# EAGLE design Touch control 1.8 (EAGLE 5.12)
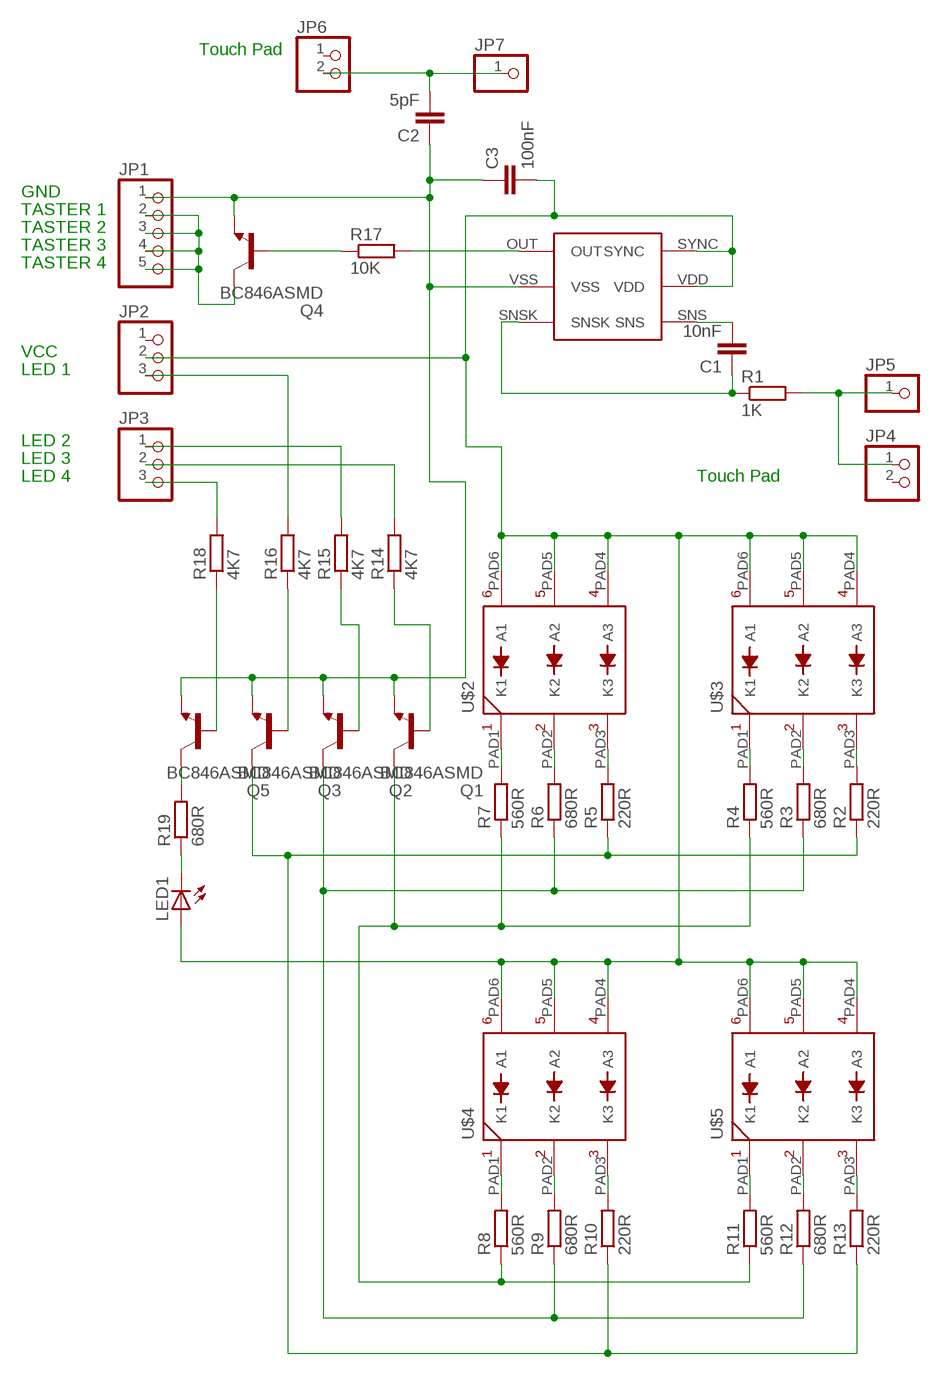
[diagram p0: schematic, sheet 1]

## Parts
C1  10nF  C-EUC1206  [C1206]
C2  5pF  C-EUC1206  [C1206]
C3  100nF  C-EUC1206  [C1206]
JP1  PINHD-1X05_2.00  [1X05M]
JP2  PINHD-1X03_2.00  [1X03M]
JP3  PINHD-1X03_2.00  [1X03M]
JP4  PINHD-1X2/90  [1X02/90]
JP5  PINHD-1X1  [1X01]
JP6  PINHD-1X2/90  [1X02/90]
JP7  PINHD-1X1  [1X01]
LED1  LEDSMT1206  [1206]
Q1  BC846ASMD  [SOT23]
Q2  BC846ASMD  [SOT23]
Q3  BC846ASMD  [SOT23]
Q4  BC846ASMD  [SOT23]
Q5  BC846ASMD  [SOT23]
QT1010  QT100A  [6-WSON]
R1  1K  RCL_R-EU_R1206  [RCL_R1206]
R2  220R  RCL_R-EU_R1206  [RCL_R1206]
R3  680R  RCL_R-EU_R1206  [RCL_R1206]
R4  560R  RCL_R-EU_R1206  [RCL_R1206]
R5  220R  RCL_R-EU_R1206  [RCL_R1206]
R6  680R  RCL_R-EU_R1206  [RCL_R1206]
R7  560R  RCL_R-EU_R1206  [RCL_R1206]
R8  560R  RCL_R-EU_R1206  [RCL_R1206]
R9  680R  RCL_R-EU_R1206  [RCL_R1206]
R10  220R  RCL_R-EU_R1206  [RCL_R1206]
R11  560R  RCL_R-EU_R1206  [RCL_R1206]
R12  680R  RCL_R-EU_R1206  [RCL_R1206]
R13  220R  RCL_R-EU_R1206  [RCL_R1206]
R14  4K7  RCL_R-EU_R1206  [RCL_R1206]
R15  4K7  RCL_R-EU_R1206  [RCL_R1206]
R16  4K7  RCL_R-EU_R1206  [RCL_R1206]
R17  10K  RCL_R-EU_R1206  [RCL_R1206]
R18  4K7  RCL_R-EU_R1206  [RCL_R1206]
R19  680R  RCL_R-EU_R1206  [RCL_R1206]
U$2  EIGENE_LED5050  [EIGENE_LED5050]
U$3  EIGENE_LED5050  [EIGENE_LED5050]
U$4  EIGENE_LED5050  [EIGENE_LED5050]
U$5  EIGENE_LED5050  [EIGENE_LED5050]

## Nets
N$1: JP1.2 JP1.3 JP1.4 JP1.5 Q4.3(C)
N$2: C1.2 QT1010.SNS
N$4: R13.2 U$5.PAD3(K3)
N$6: R12.2 U$5.PAD2(K2)
N$8: JP4.1 JP5.1 R1.2
N$9: R11.2 U$5.PAD1(K1)
N$10: C1.1 QT1010.SNSK R1.1
N$11: JP2.3 R16.2
N$12: R10.2 U$4.PAD3(K3)
N$13: JP3.1 R15.2
N$14: R9.2 U$4.PAD2(K2)
N$15: C2.2 JP6.2 JP7.1
N$17: R8.2 U$4.PAD1(K1)
N$18: QT1010.OUT R17.2
N$19: R7.2 U$2.PAD1(K1)
N$21: R6.2 U$2.PAD2(K2)
N$22: R5.2 U$2.PAD3(K3)
N$23: R4.2 U$3.PAD1(K1)
N$24: R3.2 U$3.PAD2(K2)
N$25: R2.2 U$3.PAD3(K3)
N$26: Q3.3(C) R2.1 R5.1 R10.1 R13.1
N$27: Q2.3(C) R3.1 R6.1 R9.1 R12.1
N$28: Q1.3(C) R4.1 R7.1 R8.1 R11.1
N$29: JP3.2 R14.2
N$30: Q4.1(B) R17.1
N$31: JP3.3 R18.2
N$32: Q5.1(B) R18.1
N$33: Q2.1(B) R15.1
N$34: Q1.1(B) R14.1
N$35: C2.1 C3.1 JP1.1 Q1.2(E) Q2.2(E) Q3.2(E) Q4.2(E) Q5.2(E) QT1010.VSS
N$36: Q5.3(C) R19.2
N$38: C3.2 JP2.2 LED1.A QT1010.SYNC QT1010.VDD U$2.PAD4(A3) U$2.PAD5(A2) U$2.PAD6(A1) U$3.PAD4(A3) U$3.PAD5(A2) U$3.PAD6(A1) U$4.PAD4(A3) U$4.PAD5(A2) U$4.PAD6(A1) U$5.PAD4(A3) U$5.PAD5(A2) U$5.PAD6(A1)
N$39: Q3.1(B) R16.1
N$40: LED1.C R19.1
Unconnected: JP2.1 JP4.2 JP6.1

## Notes on the sheet
- Touch Pad
- GND
- TASTER 1
- TASTER 2
- TASTER 3
- TASTER 4
- VCC
- LED 1
- LED 2
- LED 3
- LED 4 | Touch Pad

## Library data of the parts
C1-C3 = rcl:C-EU: CAPACITOR, European symbol
JP1 = pinhead-2:PINHD-1X05: PIN HEADER
JP2 JP3 = pinhead-2:PINHD-1X03: PIN HEADER
JP4 JP6 = pinhead:PINHD-1X2: PIN HEADER
JP5 JP7 = pinhead:PINHD-1X1: PIN HEADER
LED1 = led:LED: LED OSRAM: - CHIPLED LG R971, LG N971, LY N971, LG Q971, LY Q971, LO R971, LY R971 LH N974, LH R974 LS Q976, LO Q976, LY Q976 LO Q996 - Hyper CHIPLED LW Q18S LB Q993, LB Q99A, LB R99A - SideLED LS A670, LO A670, LY A670, LG A670, LP A670 LB A673, LV A673, LT A673, LW A673 LH A674 LY A675 LS A676, LA A676, LO A676, LY A676, LW A676 LS A679, LY A679, LG A679 - Hyper Micro SIDELED® LS Y876, LA Y876, LO Y876, LY Y876 LT Y87S - SmartLED LW L88C, LW L88S LB L89C, LB L89S, LG L890 LS L89K, LO L89K, LY L89K LS L896, LA L896, LO L896, LY L896 - TOPLED LS T670, LO T670, LY T670, LG T670, LP T670 LSG T670, LSP T670, LSY T670, LOP T670, LYG T670 LG T671, LOG T671, LSG T671 LB T673, LV T673, LT T673, LW T673 LH T674 LS T676, LA T676, LO T676, LY T676, LB T676, LH T676, LSB T676, LW T676 LB T67C, LV T67C, LT T67C, LS T67K, LO T67K, LY T67K, LW E67C LS E67B, LA E67B, LO E67B, LY E67B, LB E67C, LV E67C, LT E67C LW T67C LS T679, LY T679, LG T679 LS T770, LO T770, LY T770, LG T770, LP T770 LB T773, LV T773, LT T773, LW T773 LH T774 LS E675, LA E675, LY E675, LS T675 LS T776, LA T776, LO T776, LY T776, LB T776 LHGB T686 LT T68C, LB T68C - Hyper Mini TOPLED® LB M676 - Mini TOPLED Santana® LG M470 LS M47K, LO M47K, LY M47K Source: http://www.osram.convergy.de LUXEON: - LUMILED® LXK2-PW12-R00, LXK2-PW12-S00, LXK2-PW14-U00, LXK2-PW14-V00 LXK2-PM12-R00, LXK2-PM12-S00, LXK2-PM14-U00 LXK2-PE12-Q00, LXK2-PE12-R00, LXK2-PE12-S00, LXK2-PE14-T00, LXK2-PE14-U00 LXK2-PB12-K00, LXK2-PB12-L00, LXK2-PB12-M00, LXK2-PB14-N00, LXK2-PB14-P00, LXK2-PB14-Q00 LXK2-PR12-L00, LXK2-PR12-M00, LXK2-PR14-Q00, LXK2-PR14-R00 LXK2-PD12-Q00, LXK2-PD12-R00, LXK2-PD12-S00 LXK2-PH12-R00, LXK2-PH12-S00 LXK2-PL12-P00, LXK2-PL12-Q00, LXK2-PL12-R00 Source: www.luxeon.com KINGBRIGHT: KA-3528ASYC Source: www.kingbright.com
Q1-Q5 = transistor-npn:BC846*: NPN Transistor
QT1010 = QT100A:QT100A: ATMEL QT100A
R1-R19 = EAGLE_HUCKEPACK:RCL_R-EU_: RESISTOR, European symbol
U$2-U$5 = EAGLE_HUCKEPACK:EIGENE_LED5050

## Board
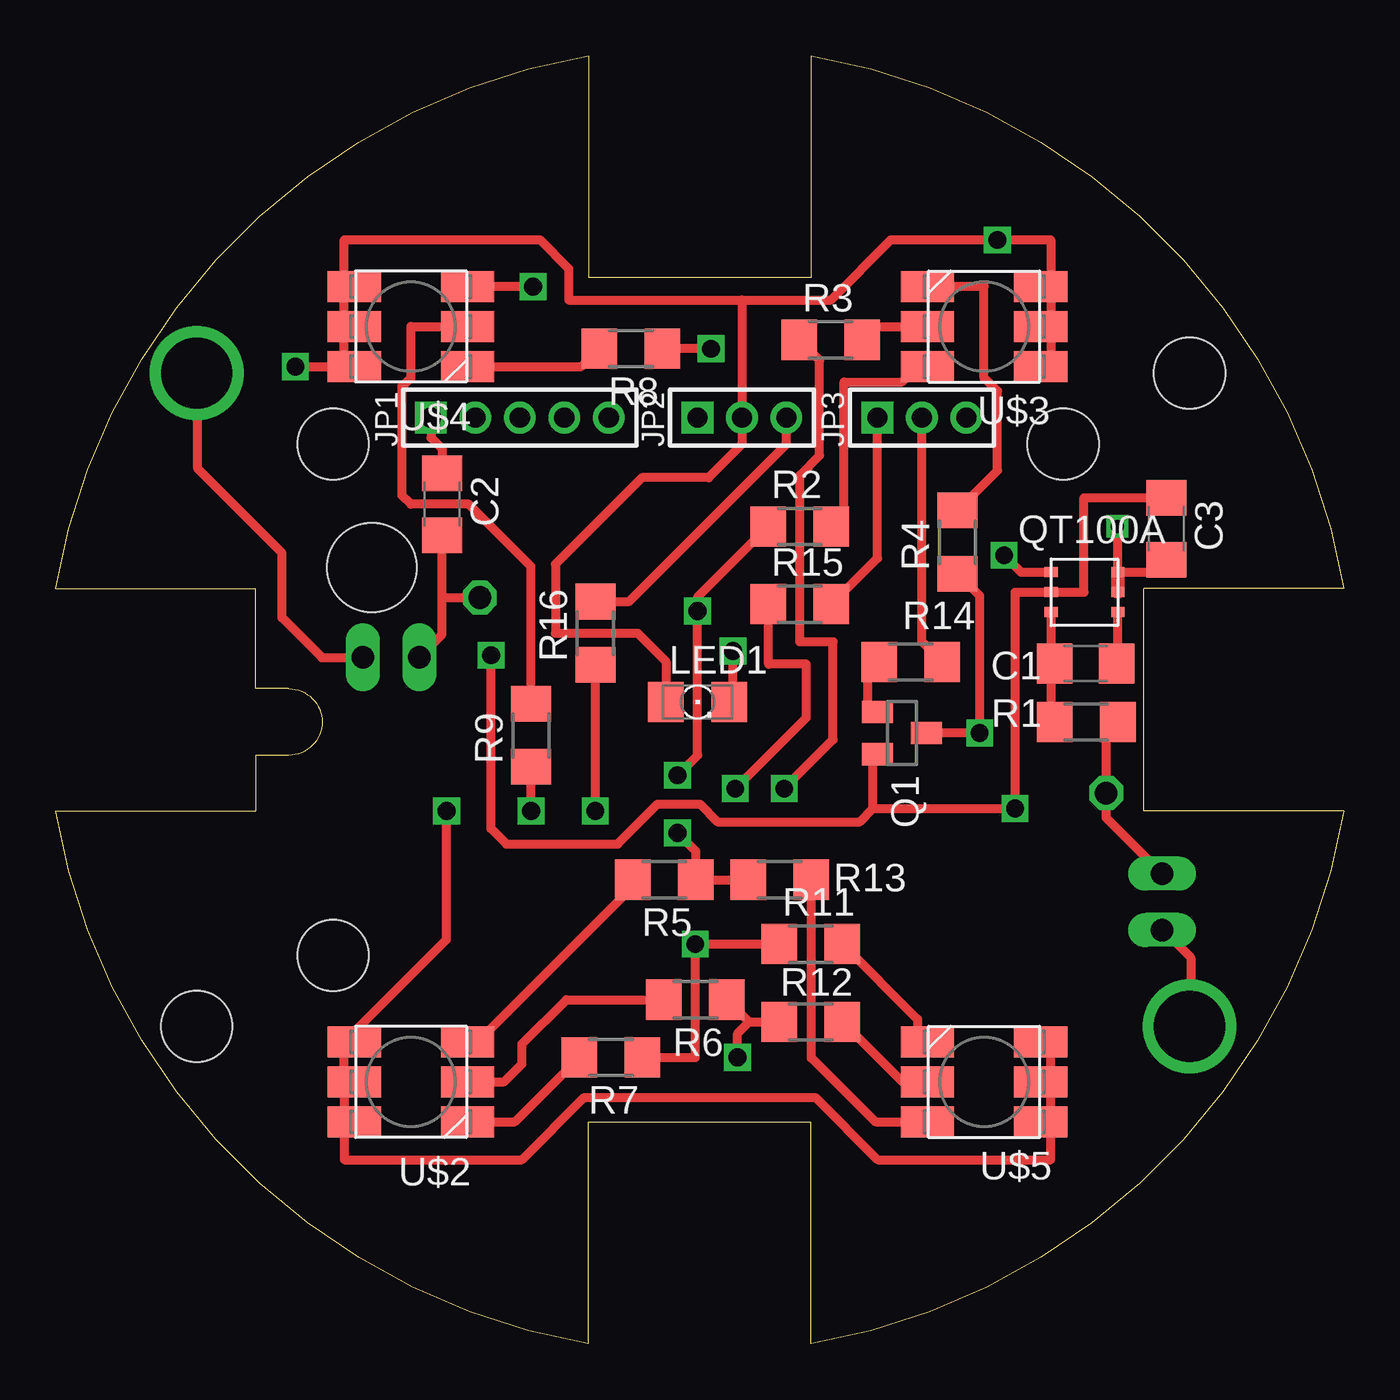
[diagram p1: board, top side]
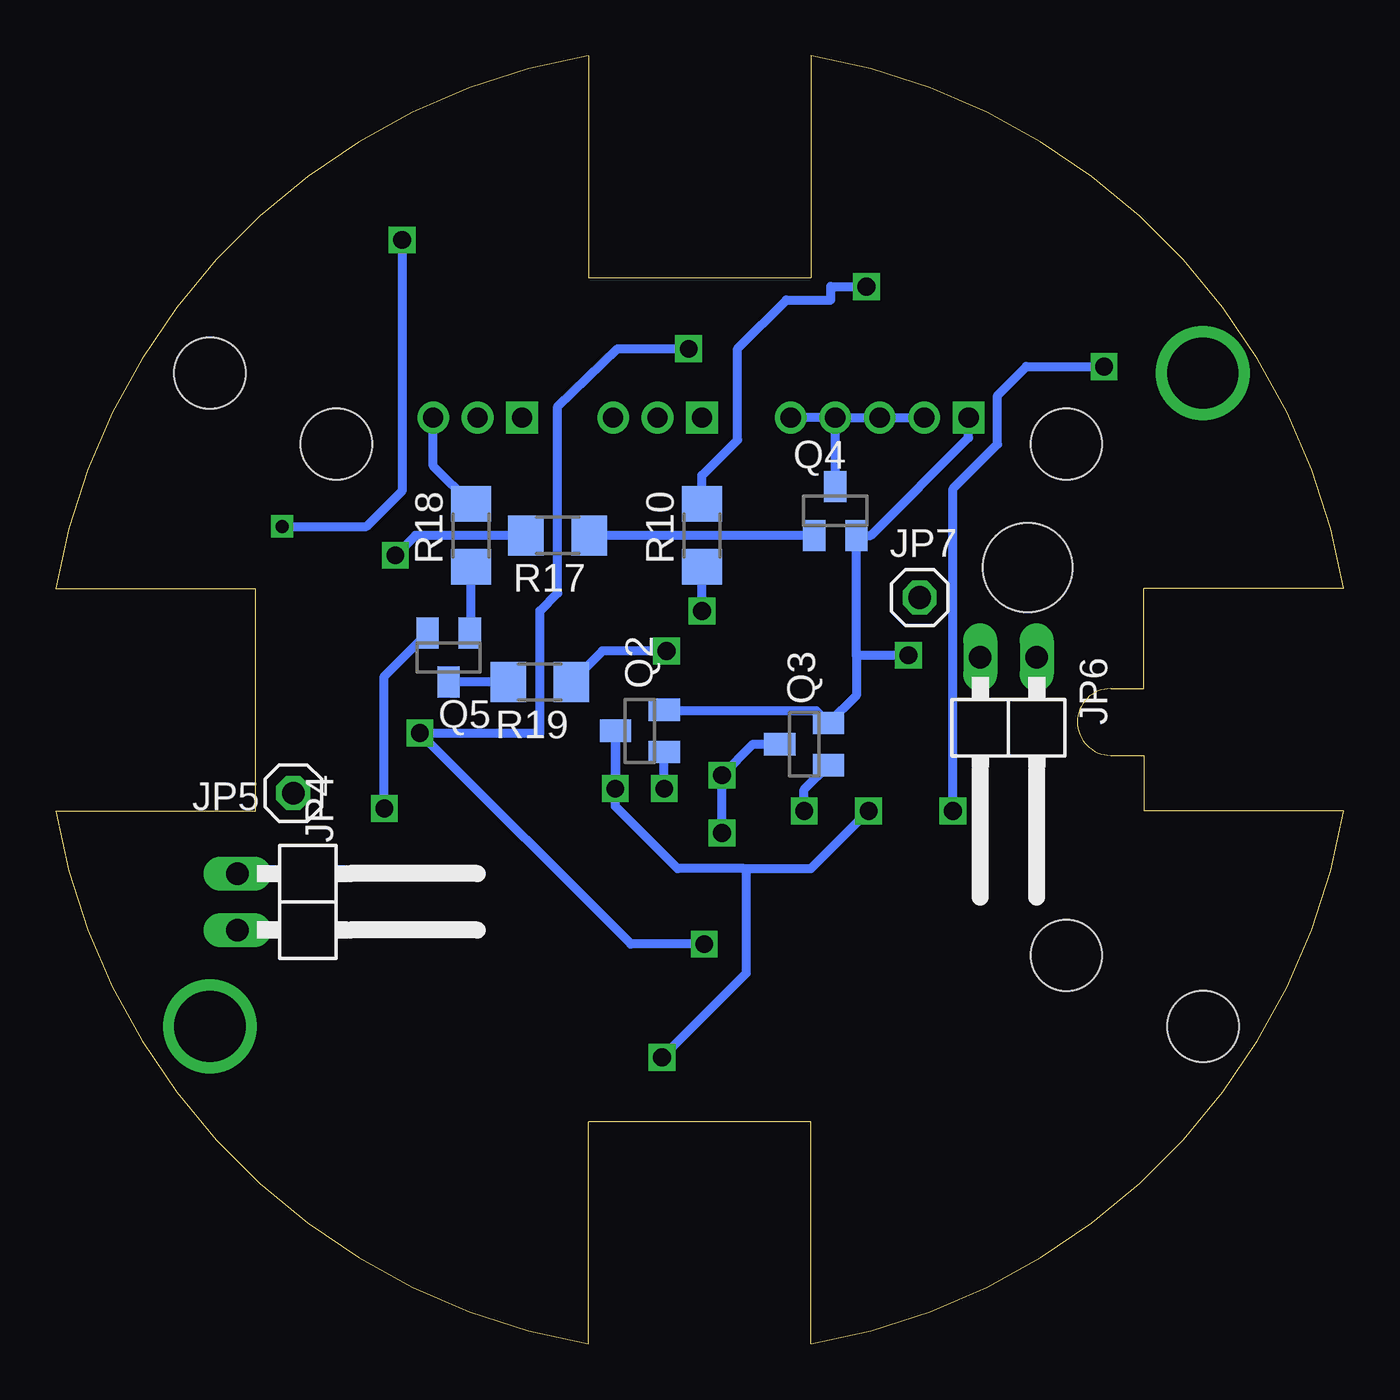
[diagram p2: board, bottom side, seen from below]

Size 58 x 58 mm. Coordinates in mm from the lower left corner, seen from the top.
Outline: 49,24 49,34 58,34 arc70 34,58 34,48 24,48 24,58 arc70 0,34 9,34 9,29.5 10.5,29.5 arc-180 10.5,26.5 9,26.5 9,24 0,24 arc70 24,0 24,10 34,10 34,0 arc70 58,24 49,24
Copper layers (1*16): Top 0.035mm / dielectric 1.5mm / Bottom 0.035mm
Design rules "default *": minimum track width 10mil, minimum drill 24mil, track to track 0.3mm, track to pad 0.3mm, pad to pad 0.3mm, via to via 0.3mm, smd to smd 8mil, copper to edge 0.3mm, drill to drill 0.3mm, minimum pad ring 10mil, minimum via ring 8mil, stop-mask expansion 4mil, vias tented up to drill 0mil, thermal gap 10mil
Holes 3.2 mm at 12.49,40.51 45.35,40.51 12.49,17.49 6.35,14.3 51.05,43.7
Holes 4 mm at 14.24,34.96

### Footprints (pad centres in the part's own frame; a part is rotated, then mirrored left to right if it is on the bottom)
C1206 = smd 1.6 x 1.8: 1 -1.4,0; 2 1.4,0
1X05M = drill 0.914 square: 1 -4,0 | drill 0.914 round: 2 -2,0; 3 0,0; 4 2,0; 5 4,0
1X03M = drill 0.914 square: 1 -2,0 | drill 0.914 round: 2 0,0; 3 2,0
1X02/90 = drill 1.016 long: 1 -1.27,-3.81; 2 1.27,-3.81
1X01 = drill 1.016 octagon: 1 0,0
1206 = smd 1.6 x 1.803: A -1.422,0; C 1.422,0
SOT23 = smd 1 x 1.4: 1 -0.95,-1.1; 2 0.95,-1.1; 3 0,1.1
6-WSON = smd 0.6 x 0.45: OUT -1,0.4; SNS 2,-1.4; SNSK -1,-1.4; SYNC 2,0.4; VDD 2,-0.5; VSS -1,-0.5
RCL_R1206 = smd 1.6 x 1.803: 1 -1.422,0; 2 1.422,0
EIGENE_LED5050 = smd 1.5 x 1.4: PAD1 -3,1.8; PAD1A -2.1,1.8; PAD2 -3,0; PAD2A -2.1,0; PAD3 -3,-1.8; PAD3A -2.1,-1.8; PAD4 3,-1.8; PAD4A 2.1,-1.8; PAD5 3,0; PAD5A 2.1,0; PAD6 3,1.8; PAD6A 2.1,1.8

### Placement (x,y rotation side)
C1  46.37,30.64 0 top
C2  17.4,37.8 270 top
C3  50,36.7 270 top
JP1  20.9,41.7 0 top
JP2  30.9,41.7 0 top
JP3  39,41.7 0 top
JP4  46,19.9 270 bottom
JP5  47.3,24.8 0 bottom
JP6  15.1,27.1 180 bottom
JP7  19.1,33.6 0 bottom
LED1  28.9,28.9 0 top
Q1  38.1,27.5 270 top
Q2  31.7,27.6 90 bottom
Q3  24.3,27 90 bottom
Q4  22.9,37.5 0 bottom
Q5  40.3,30.9 180 bottom
QT1010  45.82,34.34 0 top
R1  46.4,28 0 top
R2  33.5,36.8 0 top
R3  34.9,45.2 0 top
R4  40.6,36.1 90 top
R5  27.4,20.9 180 top
R6  28.8,15.5 180 top
R7  25,12.9 180 top
R8  25.9,44.8 180 top
R9  21.4,27.4 90 top
R10  28.9,36.4 90 bottom
R11  34,18 0 top
R12  34,14.5 0 top
R13  32.6,20.9 0 top
R14  38.5,30.7 0 top
R15  33.5,33.3 0 top
R16  24.3,32 90 top
R17  35.4,36.4 180 bottom
R18  39.3,36.4 90 bottom
R19  36.2,29.8 180 bottom
U$2  16,11.8 180 top
U$3  41.8,45.8 0 top
U$4  16,45.8 180 top
U$5  41.8,11.8 0 top

### Tracks (layer width: path | path; a pad name or v marks a point on that pad's centre or on a via)
N$1
  Bottom 0.406: JP1.4 JP1.3 JP1.2 | Q4.3 JP1.4 | JP1.4 JP1.5
N$2
  Top 0.406: QT1010.SNS 47.82,30.49 C1.2
  Top 0.61: C1.2 47.82,30.44
N$3
  Top 0.406: 51.1,16.3 51.1,17.4 49.8,18.7
N$4
  Top 0.406: R13.2 34.02,12.88 36.9,10 U$5.PAD3
N$5  (via drill 3.2 pad 3.81)
  other vias: 51.05,14.3
N$6
  Top 0.406: U$5.PAD2 38.12,11.8 R12.2
N$7  (via drill 3.2)
  other vias: 6.35,43.7
N$8
  Top 0.406: R1.2 47.3,28 JP5.1 47.3,23.68 JP4.1
N$9
  Top 0.406: U$5.PAD1 38.8,14.62 R11.2
N$10
  Top 0.406: 44.82,30.59 QT1010.SNSK | 44.82,30.59 C1.1 | 44.82,30.59 44.82,28.16 R1.1
N$11
  Top 0.406: 24.62,33.42 R16.2 25.82,33.42 32.9,40.5 JP2.3
N$12  (via drill 0.8)
  Top 0.406: v21.5,47.6 U$4.PAD3
  Bottom 0.406: v21.5,47.6 23.1,47.6 23.1,47 25.1,47 27.3,44.8 27.3,40.7 28.9,39.1 R10.2
N$13
  Top 0.406: R15.2 37,35.38 JP3.1
N$14
  Top 0.406: U$4.PAD2 16,45.8 16,43.5 15.6,43.1 15.6,38.2 16,37.8 18.6,37.8 21.4,35 R9.2
N$15
  Top 0.406: 17.4,33.7 C2.2 | JP7.1 17.5,33.6 arc-90 17.4,33.7 | 17.4,33.7 17.4,31.94 JP6.2
N$17
  Top 0.406: U$4.PAD1 23.68,44 R8.2
N$18  (via drill 0.8)
  Top 0.406: QT1010.OUT 43.46,34.74 v42.7,35.5
  Bottom 0.406: v42.7,35.5 41.8,36.4 R17.2
N$19
  Top 0.406: R7.2 20.68,10 U$2.PAD1
N$21
  Top 0.406: R6.2 23,15.5 21,13.5 21,12.6 20.2,11.8 U$2.PAD2
N$22
  Top 0.406: 26.18,21.28 R5.2 25.98,20.58 U$2.PAD3
N$23
  Top 0.406: U$3.PAD1 41.8,47.6 41.8,43.5 42.4,42.9 42.4,39.32 R4.2
N$24
  Top 0.406: R3.2 36.92,45.8 U$3.PAD2
N$25
  Top 0.406: U$3.PAD3 38.1,43.3 35.5,43.3 35.5,37.38 R2.2
N$26  (via drill 0.8)
  Top 0.406: R13.1 R5.1 28.82,22.18 v28,23 | R2.1 28.9,33.62 v28.9,33 28.9,26.5 v28,25.6
  Bottom 0.406: v28.9,33 R10.1 | Q3.3 26.6,27 v28,25.6 v28,23
N$27  (via drill 0.8)
  Top 0.406: 31.22,14.5 R12.1 | 31.22,14.5 R6.1 | v30.7,12.9 30.7,13.98 31.22,14.5 | R3.1 34.4,44.28 34.4,40 33.5,39.1 33.5,31.6 35,31.6 35,27.2 v32.8,25 | v21.4,24 R9.1
  Bottom 0.406: v30.7,12.9 26.9,16.7 26.9,21.3 27,21.4 | v32.8,25 Q2.3 32.8,24.2 30,21.4 27,21.4 | v21.4,24 24,21.4 27,21.4
N$28  (via drill 0.8)
  Top 0.406: Q1.3 v41.6,27.5 41.6,33.68 R4.1 | R7.1 28.8,12.9 v28.8,18 R11.1 | v29.5,44.8 R8.1
  Bottom 0.406: v28.8,18 32.1,18 v41.6,27.5 36.2,27.5 36.2,33 35.4,33.8 35.4,42.2 32.7,44.8 v29.5,44.8
N$29
  Top 0.406: R14.2 39,31.62 JP3.2
N$30
  Bottom 0.406: Q4.1 R17.1
N$31
  Bottom 0.406: R18.2 41,39.52 JP3.3
N$32
  Bottom 0.406: Q5.1 39.3,32.05 R18.1
N$33  (via drill 0.8)
  Top 0.406: R15.1 32.1,33.3 32.1,30.6 33.8,30.6 33.8,28.2 v30.6,25
  Bottom 0.406: v30.6,25 Q2.1
N$34
  Top 0.406: Q1.1 36.58,28.47 36.58,30.2 R14.1
N$35  (via drill 0.8)
  Top 0.406: 36.8,24.1 v43.2,24.1 43.2,33.84 QT1010.VSS 46.3,33.84 46.3,38.1 C3.1 | Q1.2 36.8,26.35 36.8,24.1 | C2.1 17.4,40.3 16.9,40.8 JP1.1 | v19.6,31 19.6,23.2 20.3,22.5 25.3,22.5 27.1,24.3 29,24.3 29.8,23.5 36.2,23.5 36.8,24.1
  Bottom 0.406: JP1.1 16.9,40.8 21.3,36.4 Q4.2 21.95,31 | Q2.2 30.55,28.5 23.75,28.5 Q3.2 21.95,29.2 21.95,31 | Q5.2 43.2,30.05 v43.2,24.1 | v19.6,31 21.95,31
N$36
  Bottom 0.406: R19.2 Q5.3
N$37
  Top 0.406: 6.4,41.8 6.4,39.4 10.2,35.6 10.2,32.7 12,30.9 13.8,30.9
N$38  (via drill 0.6, 0.8)
  Top 0.406: 30.9,47 JP2.2 30.9,40.5 29.4,39 26.4,39 22.5,35.1 22.5,32 26.2,32 27.48,30.72 LED1.A | 30.9,47 34.9,47 37.6,49.7 v42.4,49.7 44.8,49.7 U$3.PAD6 U$3.PAD5 U$3.PAD4 | 30.9,47 23.1,47 23.1,48.4 21.8,49.7 13,49.7 U$4.PAD4 U$4.PAD5 U$4.PAD6 v10.8,44 | U$5.PAD6 U$5.PAD5 U$5.PAD4 44.8,8.3 37,8.3 34.2,11.1 23.8,11.1 21,8.3 13,8.3 U$2.PAD6 U$2.PAD5 U$2.PAD4 17.6,18.2 v17.6,24 | 47.82,36.78 v47.8,36.8 47.82,36.8 QT1010.SYNC 50,34.74 C3.2
  Top 0.61: QT1010.SYNC QT1010.VDD
  Bottom 0.406: v17.6,24 17.6,38.5 15.6,40.5 15.6,42.7 14.3,44 v10.8,44 | v42.4,49.7 42.4,38.4 44,36.8 v47.8,36.8
N$39  (via drill 0.8)
  Top 0.406: v24.3,24 R16.1
  Bottom 0.406: v24.3,24 24.3,24.95 Q3.1
N$40  (via drill 0.8)
  Top 0.406: LED1.C 30.5,29.18 v30.5,31.2
  Bottom 0.406: v30.5,31.2 33.38,31.2 R19.1